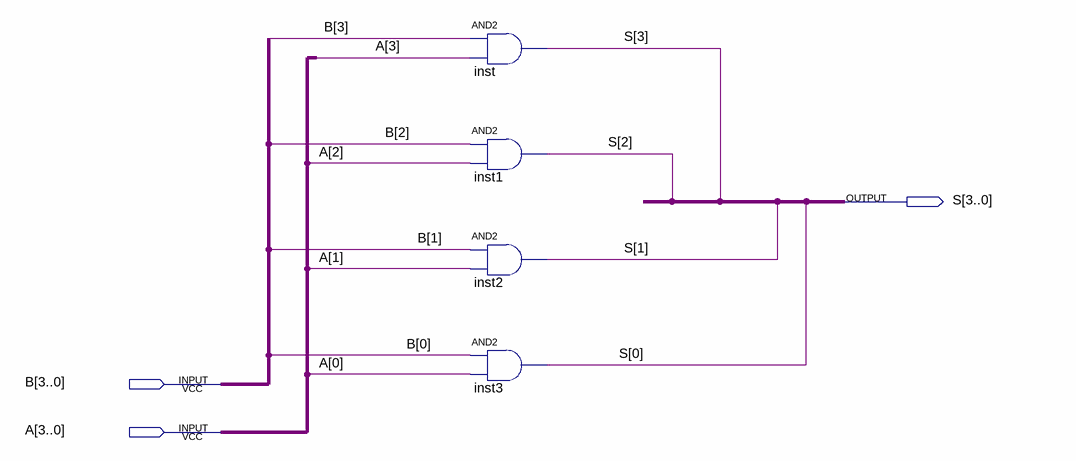
[diagram p0: schematic sheet]
// Quartus schematic ComparadorAnd.bdf as structural Verilog: 4 symbols, 3 pins
module ComparadorAnd (
  input  [3:0] B,
  input  [3:0] A,
  output [3:0] S
);

  and inst (S[3], B[3], A[3]);
  and inst1 (S[2], B[2], A[2]);
  and inst2 (S[1], B[1], A[1]);
  and inst3 (S[0], B[0], A[0]);
endmodule
